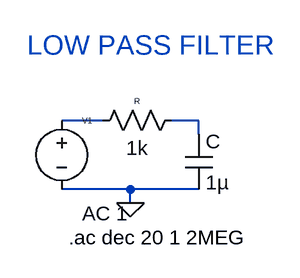
[diagram p0: schematic 1)low_pass_filter.asc]
1)low_pass_filter.asc, the LTspice schematic file:
Version 4
SHEET 1 880 680
WIRE 192 96 144 96
WIRE 304 96 272 96
WIRE 304 112 304 96
WIRE 224 176 144 176
WIRE 304 176 224 176
WIRE 224 192 224 176
FLAG 224 192 0
SYMBOL voltage 144 80 R0
WINDOW 0 24 16 Left 0
WINDOW 123 24 124 Left 2
WINDOW 39 0 0 Left 0
SYMATTR InstName V1
SYMATTR Value2 AC 1
SYMATTR Value ""
SYMBOL res 288 80 R90
WINDOW 0 0 56 VBottom 0
WINDOW 3 32 56 VTop 2
SYMATTR InstName R
SYMATTR Value 1k
SYMBOL cap 288 112 R0
SYMATTR InstName C
SYMATTR Value 1µ
TEXT 152 232 Left 2 !.ac dec 20 1 2MEG
TEXT 104 8 Left 3 ;LOW PASS FILTER

The netlist it stands for:
* 1)low_pass_filter.asc
V1 N001 0 AC 1
R N002 N001 1k
C N002 0 1µ
.ac dec 20 1 2MEG
* LOW PASS FILTER
.backanno
.end